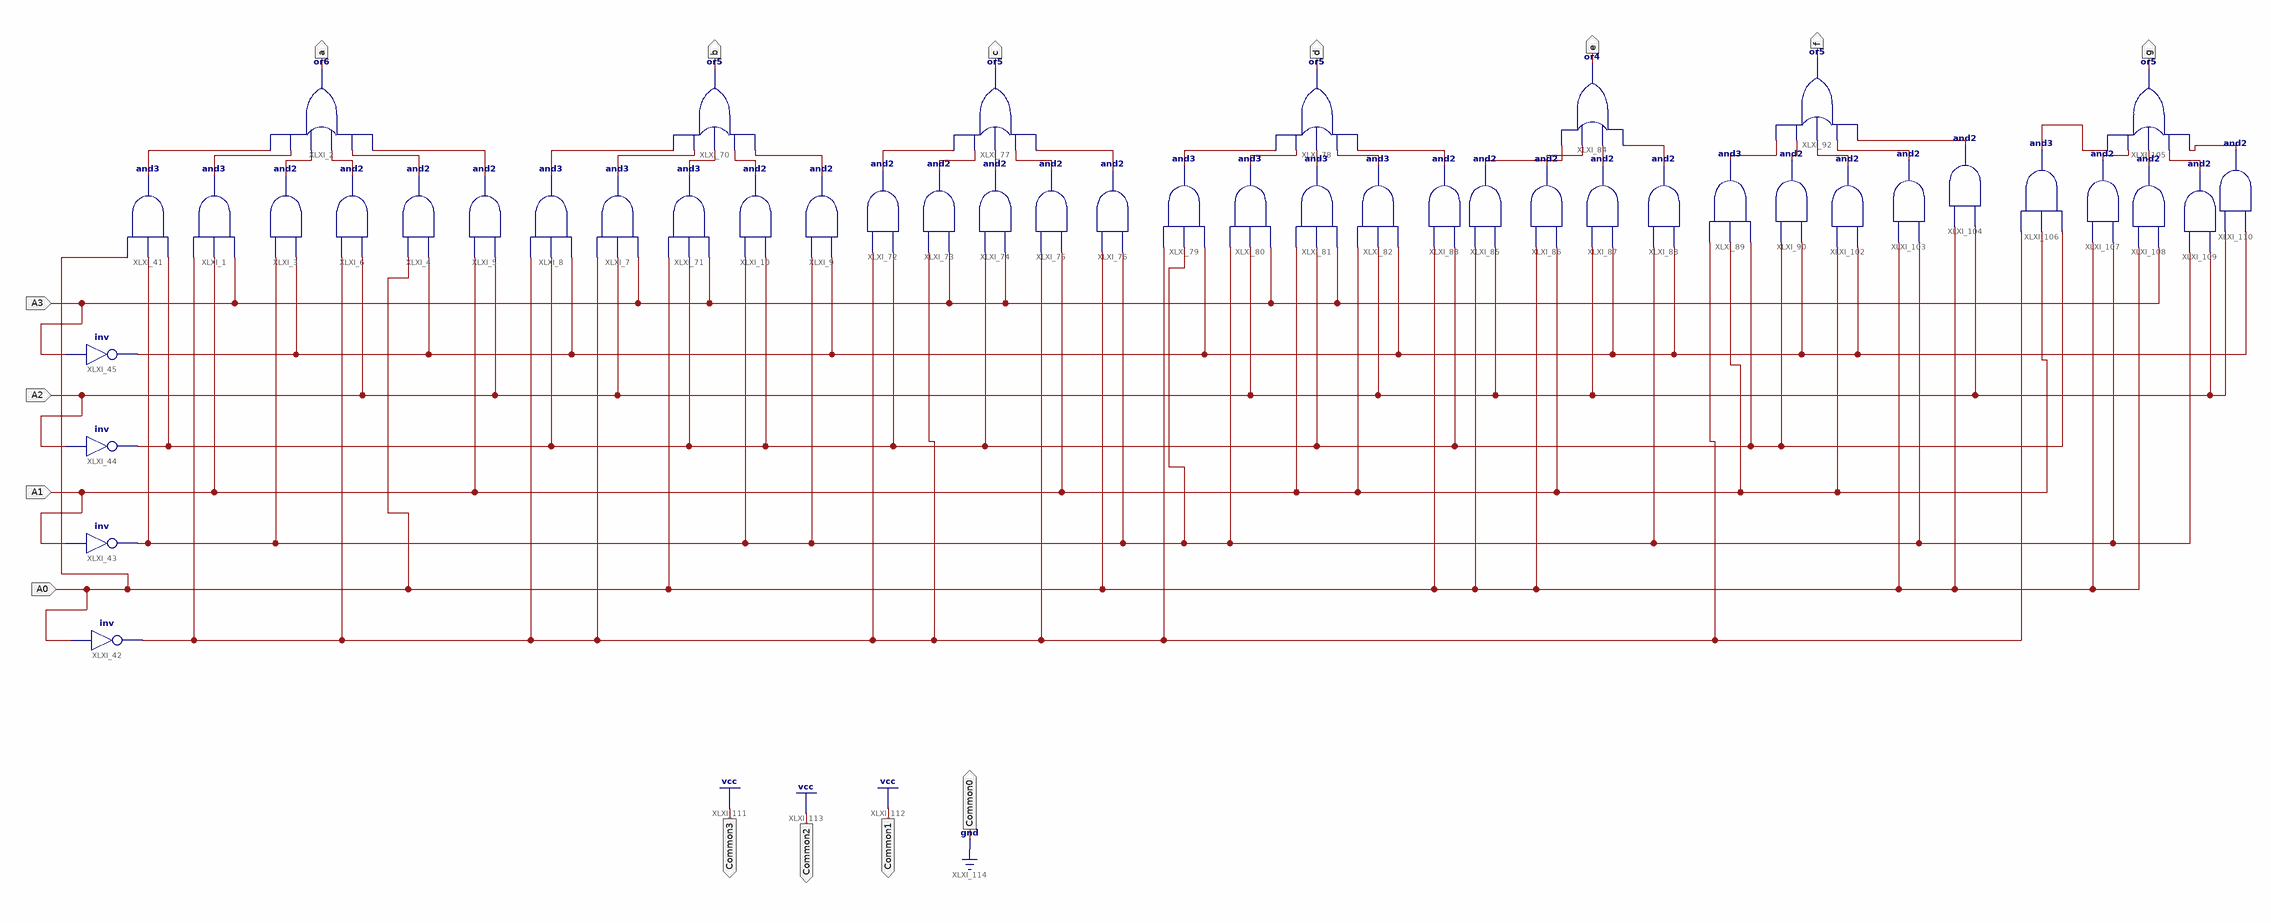
[diagram p0: schematic sheet 1]
// Xilinx ISE schematic sevensegment.sch (spartan6) as structural Verilog: 46 symbols, 15 ports
module sevensegment (
  input  A2,
  input  A1,
  input  A0,
  input  A3,
  output a,
  output b,
  output c,
  output d,
  output e,
  output f,
  output g,
  output Common3,
  output Common1,
  output Common2,
  output Common0
);

  wire XLXN_1, XLXN_2, XLXN_3, XLXN_4, XLXN_5, XLXN_6, XLXN_7, XLXN_8, XLXN_9, XLXN_10, XLXN_11, XLXN_12,
       XLXN_13, XLXN_14, XLXN_15, XLXN_16, XLXN_17, XLXN_18, XLXN_19, XLXN_61, XLXN_79, XLXN_85, XLXN_86,
       XLXN_89, XLXN_90, XLXN_96, XLXN_97, XLXN_102, XLXN_108, XLXN_109, XLXN_110, XLXN_114, XLXN_119,
       XLXN_120, XLXN_121, XLXN_123, XLXN_124, XLXN_125, XLXN_207;

  and XLXI_1 (XLXN_1, A3, A1, XLXN_110);
  or XLXI_2 (a, XLXN_5, XLXN_4, XLXN_3, XLXN_2, XLXN_1, XLXN_61);
  and XLXI_3 (XLXN_2, XLXN_125, XLXN_207);
  and XLXI_4 (XLXN_4, XLXN_125, A0);
  and XLXI_5 (XLXN_5, A2, A1);
  and XLXI_6 (XLXN_3, A2, XLXN_110);
  and XLXI_7 (XLXN_7, A3, A2, XLXN_110);
  and XLXI_8 (XLXN_6, XLXN_125, XLXN_114, XLXN_110);
  and XLXI_9 (XLXN_10, XLXN_125, XLXN_207);
  and XLXI_10 (XLXN_9, XLXN_114, XLXN_207);
  or XLXI_70 (b, XLXN_10, XLXN_9, XLXN_8, XLXN_7, XLXN_6);
  and XLXI_71 (XLXN_8, A3, XLXN_114, A0);
  and XLXI_72 (XLXN_11, XLXN_114, XLXN_110);
  and XLXI_73 (XLXN_12, A3, XLXN_110);
  and XLXI_74 (XLXN_13, A3, XLXN_114);
  and XLXI_75 (XLXN_14, A1, XLXN_110);
  and XLXI_76 (XLXN_15, XLXN_207, A0);
  or XLXI_77 (c, XLXN_15, XLXN_14, XLXN_13, XLXN_12, XLXN_11);
  or XLXI_78 (d, XLXN_79, XLXN_19, XLXN_18, XLXN_17, XLXN_16);
  and XLXI_79 (XLXN_16, XLXN_125, XLXN_207, XLXN_110);
  and XLXI_80 (XLXN_17, A3, A2, XLXN_207);
  and XLXI_81 (XLXN_18, A3, XLXN_114, A1);
  and XLXI_82 (XLXN_19, XLXN_125, A2, A1);
  and XLXI_83 (XLXN_79, XLXN_114, A0);
  or XLXI_84 (e, XLXN_90, XLXN_89, XLXN_86, XLXN_85);
  and XLXI_85 (XLXN_85, A2, A0);
  and XLXI_86 (XLXN_86, A1, A0);
  and XLXI_87 (XLXN_89, XLXN_125, A2);
  and XLXI_88 (XLXN_90, XLXN_125, XLXN_207);
  and XLXI_89 (XLXN_96, XLXN_114, A1, XLXN_110);
  and XLXI_90 (XLXN_97, XLXN_125, XLXN_114);
  and XLXI_103 (XLXN_108, XLXN_207, A0);
  or XLXI_92 (f, XLXN_109, XLXN_108, XLXN_102, XLXN_97, XLXN_96);
  and XLXI_102 (XLXN_102, XLXN_125, A1);
  and XLXI_104 (XLXN_109, A2, A0);
  or XLXI_105 (g, XLXN_124, XLXN_123, XLXN_121, XLXN_120, XLXN_119);
  and XLXI_106 (XLXN_119, XLXN_114, A1, XLXN_110);
  and XLXI_107 (XLXN_120, XLXN_207, A0);
  and XLXI_108 (XLXN_121, A3, A0);
  and XLXI_109 (XLXN_123, A2, XLXN_207);
  and XLXI_41 (XLXN_61, XLXN_114, XLXN_207, A0);
  not XLXI_42 (XLXN_110, A0);
  not XLXI_43 (XLXN_207, A1);
  not XLXI_44 (XLXN_114, A2);
  not XLXI_45 (XLXN_125, A3);
  and XLXI_110 (XLXN_124, XLXN_125, A2);

  assign Common0 = 1'b0;
  assign Common1 = 1'b1;
  assign Common2 = 1'b1;
  assign Common3 = 1'b1;
endmodule
